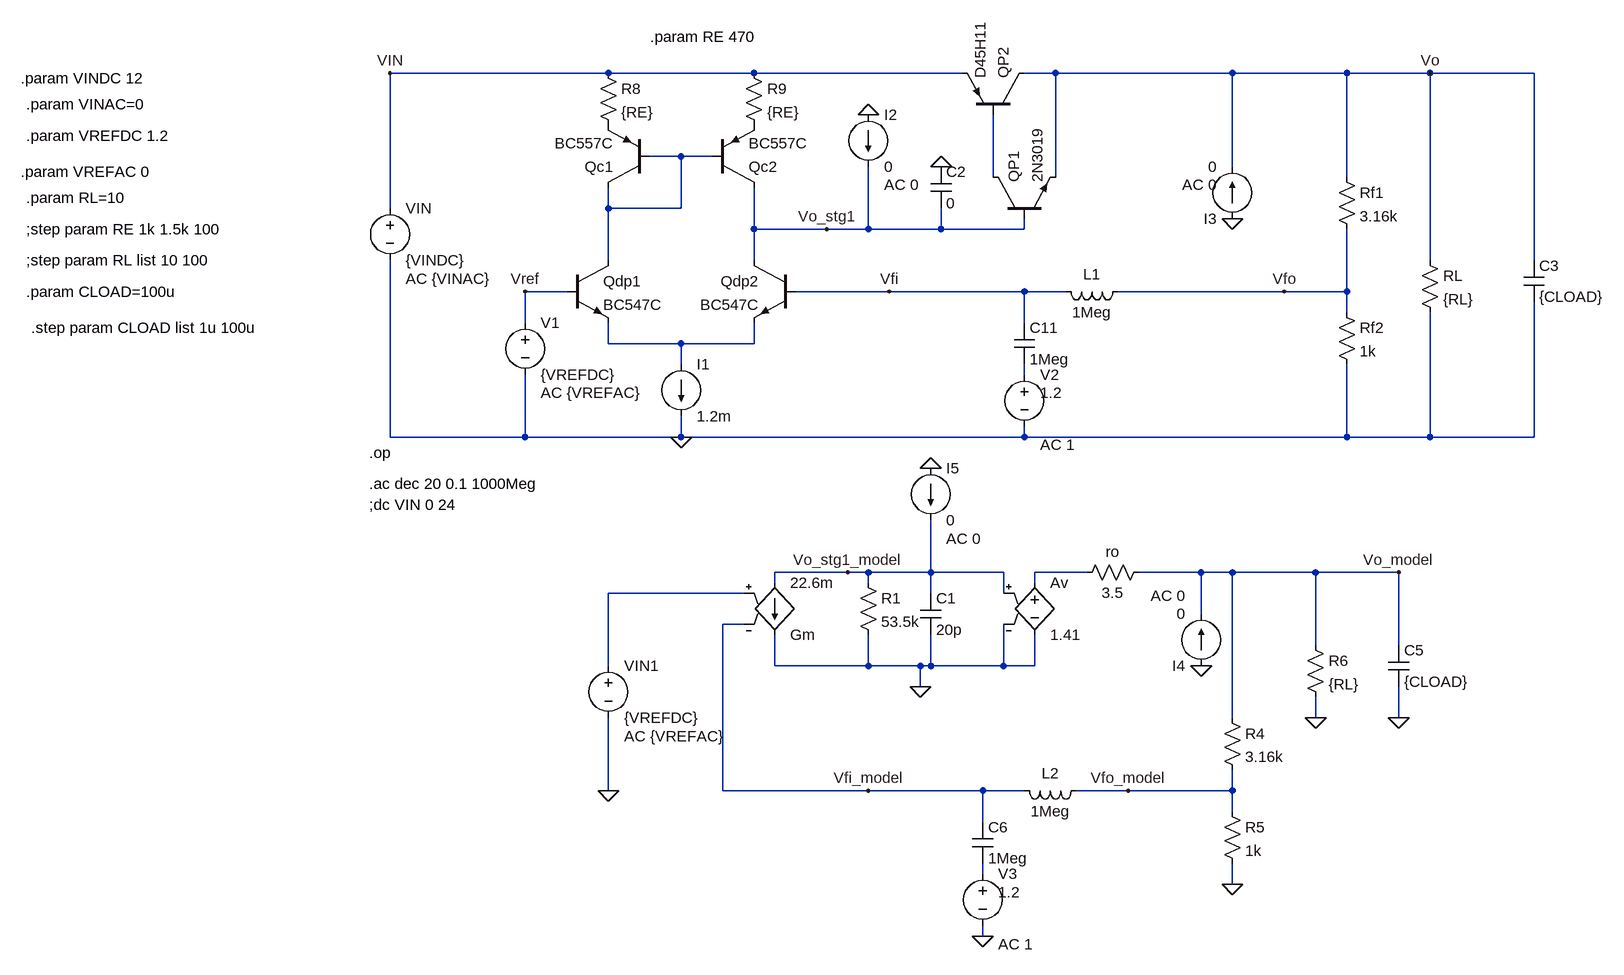
[diagram p0: schematic Regulador_Lineal_version4_loopgain_sin_compensar.asc]
Regulador_Lineal_version4_loopgain_sin_compensar.asc, the LTspice schematic file:
Version 4
SHEET 1 2160 1324
WIRE 96 -32 -240 -32
WIRE 320 -32 96 -32
WIRE 640 -32 320 -32
WIRE 784 -32 736 -32
WIRE 1056 -32 784 -32
WIRE 1232 -32 1056 -32
WIRE 1360 -32 1232 -32
WIRE 1520 -32 1360 -32
WIRE 208 96 160 96
WIRE 256 96 208 96
WIRE 1056 112 1056 -32
WIRE 688 128 688 32
WIRE 784 128 784 -32
WIRE 1232 128 1232 -32
WIRE -240 176 -240 -32
WIRE 96 176 96 144
WIRE 208 176 208 96
WIRE 208 176 96 176
WIRE 320 208 320 144
WIRE 432 208 320 208
WIRE 496 208 496 112
WIRE 496 208 432 208
WIRE 608 208 608 176
WIRE 608 208 496 208
WIRE 736 208 736 192
WIRE 736 208 608 208
WIRE 96 256 96 176
WIRE 320 256 320 208
WIRE 1360 256 1360 -32
WIRE 1520 256 1520 -32
WIRE 32 304 -32 304
WIRE 528 304 384 304
WIRE 736 304 528 304
WIRE 800 304 736 304
WIRE 1136 304 880 304
WIRE 1232 304 1232 208
WIRE 1232 304 1136 304
WIRE 1232 336 1232 304
WIRE -32 352 -32 304
WIRE 736 352 736 304
WIRE 96 384 96 352
WIRE 208 384 96 384
WIRE 320 384 320 352
WIRE 320 384 208 384
WIRE 208 416 208 384
WIRE 736 432 736 416
WIRE -240 528 -240 256
WIRE -32 528 -32 432
WIRE -32 528 -240 528
WIRE 208 528 208 496
WIRE 208 528 -32 528
WIRE 736 528 736 512
WIRE 736 528 208 528
WIRE 1232 528 1232 416
WIRE 1232 528 736 528
WIRE 1360 528 1360 336
WIRE 1360 528 1232 528
WIRE 1520 528 1520 320
WIRE 1520 528 1360 528
WIRE 464 736 352 736
WIRE 496 736 464 736
WIRE 592 736 592 656
WIRE 592 736 496 736
WIRE 704 736 592 736
WIRE 832 736 752 736
WIRE 1008 736 912 736
WIRE 1056 736 1008 736
WIRE 1184 736 1056 736
WIRE 1312 736 1184 736
WIRE 352 752 352 736
WIRE 496 752 496 736
WIRE 752 752 752 736
WIRE 304 768 96 768
WIRE 592 768 592 736
WIRE 704 768 704 736
WIRE 1008 800 1008 736
WIRE 304 816 272 816
WIRE 1184 848 1184 736
WIRE 1312 848 1312 736
WIRE 96 880 96 768
WIRE 352 880 352 832
WIRE 496 880 496 832
WIRE 496 880 352 880
WIRE 576 880 496 880
WIRE 592 880 592 832
WIRE 592 880 576 880
WIRE 704 880 704 816
WIRE 704 880 592 880
WIRE 752 880 752 832
WIRE 752 880 704 880
WIRE 576 912 576 880
WIRE 1056 960 1056 736
WIRE 1184 960 1184 928
WIRE 1312 960 1312 912
WIRE 96 1072 96 960
WIRE 272 1072 272 816
WIRE 496 1072 272 1072
WIRE 672 1072 496 1072
WIRE 736 1072 672 1072
WIRE 896 1072 816 1072
WIRE 1056 1072 1056 1040
WIRE 1056 1072 896 1072
WIRE 1056 1104 1056 1072
WIRE 672 1120 672 1072
WIRE 672 1200 672 1184
WIRE 1056 1216 1056 1184
WIRE 672 1296 672 1280
FLAG 208 528 0
FLAG 1360 -32 Vo
FLAG -32 304 Vref
FLAG -240 -32 VIN
FLAG 1136 304 Vfo
FLAG 528 304 Vfi
FLAG 576 912 0
FLAG 1056 1216 0
FLAG 1184 960 0
FLAG 1312 960 0
FLAG 96 1072 0
FLAG 1312 736 Vo_model
FLAG 672 1296 0
FLAG 496 32 0
FLAG 432 208 Vo_stg1
FLAG 464 736 Vo_stg1_model
FLAG 896 1072 Vfo_model
FLAG 496 1072 Vfi_model
FLAG 1056 192 0
FLAG 1008 880 0
FLAG 608 112 0
FLAG 592 576 0
DATAFLAG 1200 -32 ""
DATAFLAG 624 304 ""
DATAFLAG 1040 736 ""
SYMBOL pnp 160 144 R180
SYMATTR InstName Qc1
SYMATTR Value BC557C
SYMBOL pnp 256 144 M180
SYMATTR InstName Qc2
SYMATTR Value BC557C
SYMBOL npn 32 256 R0
SYMATTR InstName Qdp1
SYMATTR Value BC547C
SYMBOL npn 384 256 M0
SYMATTR InstName Qdp2
SYMATTR Value BC547C
SYMBOL pnp 736 32 M270
SYMATTR InstName QP2
SYMATTR Value D45H11
SYMBOL npn 688 192 R270
SYMATTR InstName QP1
SYMATTR Value 2N3019
SYMBOL res 1216 112 R0
SYMATTR InstName Rf1
SYMATTR Value 3.16k
SYMBOL res 1216 320 R0
SYMATTR InstName Rf2
SYMATTR Value 1k
SYMBOL res 1344 240 R0
SYMATTR InstName RL
SYMATTR Value {RL}
SYMBOL voltage -32 336 R0
WINDOW 123 24 124 Left 2
WINDOW 39 0 0 Left 0
SYMATTR Value2 AC {VREFAC}
SYMATTR InstName V1
SYMATTR Value {VREFDC}
SYMBOL voltage -240 160 R0
WINDOW 123 24 124 Left 2
WINDOW 39 0 0 Left 0
SYMATTR Value2 AC {VINAC}
SYMATTR InstName VIN
SYMATTR Value {VINDC}
SYMBOL res 80 -48 R0
SYMATTR InstName R8
SYMATTR Value {RE}
SYMBOL res 304 -48 R0
SYMATTR InstName R9
SYMATTR Value {RE}
SYMBOL cap 1504 256 R0
SYMATTR InstName C3
SYMATTR Value {CLOAD}
SYMBOL ind 896 288 R90
WINDOW 0 5 56 VBottom 2
WINDOW 3 32 56 VTop 2
SYMATTR InstName L1
SYMATTR Value 1Meg
SYMBOL cap 720 352 R0
SYMATTR InstName C11
SYMATTR Value 1Meg
SYMBOL voltage 736 416 R0
WINDOW 123 24 124 Left 2
WINDOW 39 0 0 Left 0
WINDOW 3 24 44 Left 2
SYMATTR Value2 AC 1
SYMATTR Value 1.2
SYMATTR InstName V2
SYMBOL current 208 416 R0
WINDOW 123 0 0 Left 0
WINDOW 39 0 0 Left 0
SYMATTR InstName I1
SYMATTR Value 1.2m
SYMBOL g2 352 848 M180
SYMATTR InstName Gm
SYMATTR Value 22.6m
SYMBOL res 480 736 R0
SYMATTR InstName R1
SYMATTR Value 53.5k
SYMBOL cap 576 768 R0
SYMATTR InstName C1
SYMATTR Value 20p
SYMBOL e 752 736 R0
SYMATTR InstName Av
SYMATTR Value 1.41
SYMBOL res 928 720 R90
WINDOW 0 0 56 VBottom 2
WINDOW 3 32 56 VTop 2
SYMATTR InstName ro
SYMATTR Value 3.5
SYMBOL res 1040 944 R0
SYMATTR InstName R4
SYMATTR Value 3.16k
SYMBOL res 1040 1088 R0
SYMATTR InstName R5
SYMATTR Value 1k
SYMBOL res 1168 832 R0
SYMATTR InstName R6
SYMATTR Value {RL}
SYMBOL cap 1296 848 R0
SYMATTR InstName C5
SYMATTR Value {CLOAD}
SYMBOL voltage 96 864 R0
WINDOW 123 24 124 Left 2
WINDOW 39 0 0 Left 0
SYMATTR Value2 AC {VREFAC}
SYMATTR InstName VIN1
SYMATTR Value {VREFDC}
SYMBOL ind 832 1056 R90
WINDOW 0 5 56 VBottom 2
WINDOW 3 32 56 VTop 2
SYMATTR InstName L2
SYMATTR Value 1Meg
SYMBOL cap 656 1120 R0
SYMATTR InstName C6
SYMATTR Value 1Meg
SYMBOL voltage 672 1184 R0
WINDOW 123 24 124 Left 2
WINDOW 39 0 0 Left 0
WINDOW 3 24 44 Left 2
SYMATTR Value2 AC 1
SYMATTR Value 1.2
SYMATTR InstName V3
SYMBOL current 496 32 R0
WINDOW 123 24 108 Left 2
WINDOW 39 0 0 Left 0
SYMATTR Value2 AC 0
SYMATTR InstName I2
SYMATTR Value 0
SYMBOL current 1056 192 R180
WINDOW 123 24 52 Left 2
WINDOW 39 0 0 Left 0
SYMATTR Value2 AC 0
SYMATTR InstName I3
SYMATTR Value 0
SYMBOL current 1008 880 R180
WINDOW 123 24 108 Left 2
WINDOW 39 0 0 Left 0
SYMATTR Value2 AC 0
SYMATTR InstName I4
SYMATTR Value 0
SYMBOL cap 592 112 R0
SYMATTR InstName C2
SYMATTR Value 0
SYMBOL current 592 576 R0
WINDOW 123 24 108 Left 2
WINDOW 39 0 0 Left 0
SYMATTR Value2 AC 0
SYMATTR InstName I5
SYMATTR Value 0
TEXT -272 552 Left 2 !.op
TEXT -272 600 Left 2 !.ac dec 20 0.1 1000Meg
TEXT -808 -24 Left 2 !.param VINDC 12
TEXT -800 16 Left 2 !.param VINAC=0
TEXT -800 64 Left 2 !.param VREFDC 1.2
TEXT -808 120 Left 2 !.param VREFAC 0
TEXT -800 160 Left 2 !.param RL=10
TEXT -272 632 Left 2 !;dc VIN 0 24
TEXT -800 208 Left 2 !;step param RE 1k 1.5k 100
TEXT 160 -88 Left 2 !.param RE 470
TEXT -800 256 Left 2 !;step param RL list 10 100
TEXT -800 304 Left 2 !.param CLOAD=100u
TEXT -792 360 Left 2 !.step param CLOAD list 1u 100u

The netlist it stands for:
* Regulador_Lineal_version4_loopgain_sin_compensar.asc
Qc1 N001 N001 P001 0 BC557C
Qc2 Vo_stg1 N001 P002 0 BC557C
Qdp1 N001 Vref N003 0 BC547C
Qdp2 Vo_stg1 Vfi N003 0 BC547C
QP2 Vo N002 VIN 0 D45H11
QP1 N002 Vo_stg1 Vo 0 2N3019
Rf1 Vo Vfo 3.16k
Rf2 Vfo 0 1k
RL Vo 0 {RL}
V1 Vref 0 {VREFDC} AC {VREFAC}
VIN VIN 0 {VINDC} AC {VINAC}
R8 VIN P001 {RE}
R9 VIN P002 {RE}
C3 Vo 0 {CLOAD}
L1 Vfo Vfi 1Meg
C11 Vfi N004 1Meg
V2 N004 0 1.2 AC 1
I1 N003 0 1.2m
Gm Vo_stg1_model 0 N006 Vfi_model 22.6m
R1 Vo_stg1_model 0 53.5k
C1 Vo_stg1_model 0 20p
E§Av N005 0 Vo_stg1_model 0 1.41
ro Vo_model N005 3.5
R4 Vo_model Vfo_model 3.16k
R5 Vfo_model 0 1k
R6 Vo_model 0 {RL}
C5 Vo_model 0 {CLOAD}
VIN1 N006 0 {VREFDC} AC {VREFAC}
L2 Vfo_model Vfi_model 1Meg
C6 Vfi_model N007 1Meg
V3 N007 0 1.2 AC 1
I2 0 Vo_stg1 0 AC 0
I3 0 Vo 0 AC 0
I4 0 Vo_model 0 AC 0
C2 0 Vo_stg1 0
I5 0 Vo_stg1_model 0 AC 0
.model NPN NPN
.model PNP PNP
.lib standard.bjt
.op
.ac dec 20 0.1 1000Meg
.param VINDC 12
.param VINAC=0
.param VREFDC 1.2
.param VREFAC 0
.param RL=10
;dc VIN 0 24
;step param RE 1k 1.5k 100
.param RE 470
;step param RL list 10 100
.param CLOAD=100u
.step param CLOAD list 1u 100u
.backanno
.end